# Altium schematic sheet Def_sch.SchDoc: title
size A4
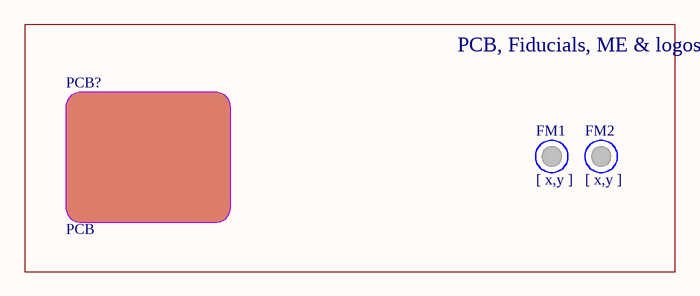
[diagram p0: Def_sch.SchDoc]

## Parts
FM1  [ x,y ]  [FM_40mil_2F]  (no BOM)
FM2  [ x,y ]  [FM_40mil_2F]  (no BOM)
PCB?  PCB  (mechanical)

## Blocks framed on the sheet
PCB, Fiducials, ME & logos: FM1 FM2 PCB?

## Notes on the sheet
- Title:
- Project:
- File:
- Revision:
- Date:
- Size:
- A4
- Drawn by:

## Library data of the parts
FM1 FM2 = FM_40mil_2F: Fiducial Mark 40 Mil 2 Face; Last modified by: C-D Viveros; Last modified date: 20190319
PCB? = PCB: material, thickness, plating, layers; Manufacturer: =GlobalFactory; Manufacturer Part Number: =GlobalProjectName+'_GRB'+GlobalTPN+'_'+GlobalBoardName+'_'+GlobalVersion+'.'+GlobalRevision; Last modified by: J.Jaramillo; Last modified date: 040726; Supplier Part Number 1: =GlobalProjectName+'_GRB'+GlobalTPN+'_'+GlobalBoardName+'_'+GlobalVersion+'.'+GlobalRevision; Supplier 1: =GlobalFactory